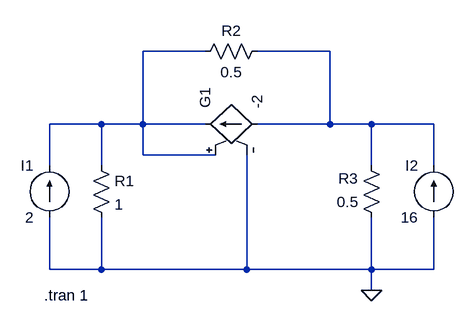
[diagram p0: schematic g3_p11.asc]
g3_p11.asc, the LTspice schematic file:
Version 4
SHEET 1 880 680
WIRE 128 -32 32 -32
WIRE 320 -32 208 -32
WIRE -32 80 -112 80
WIRE 32 80 32 -32
WIRE 32 80 -32 80
WIRE 128 80 32 80
WIRE 320 80 320 -32
WIRE 320 80 208 80
WIRE 384 80 320 80
WIRE 480 80 384 80
WIRE 32 128 32 80
WIRE 144 128 32 128
WIRE -112 144 -112 80
WIRE -32 144 -32 80
WIRE 384 144 384 80
WIRE 480 144 480 80
WIRE -112 304 -112 224
WIRE -32 304 -32 224
WIRE -32 304 -112 304
WIRE 192 304 192 128
WIRE 192 304 -32 304
WIRE 384 304 384 224
WIRE 384 304 192 304
WIRE 480 304 480 224
WIRE 480 304 384 304
WIRE 384 336 384 304
FLAG 384 336 0
SYMBOL res -48 128 R0
SYMATTR InstName R1
SYMATTR Value 1
SYMBOL res 224 -48 R90
WINDOW 0 0 56 VBottom 2
WINDOW 3 32 56 VTop 2
SYMATTR InstName R2
SYMATTR Value 0.5
SYMBOL res 400 240 R180
WINDOW 0 36 76 Left 2
WINDOW 3 36 40 Left 2
SYMATTR InstName R3
SYMATTR Value 0.5
SYMBOL current -112 224 R180
WINDOW 0 24 80 Left 2
WINDOW 3 24 0 Left 2
SYMATTR InstName I1
SYMATTR Value 2
SYMBOL current 480 224 R180
WINDOW 0 24 80 Left 2
WINDOW 3 24 0 Left 2
SYMATTR InstName I2
SYMATTR Value 16
SYMBOL g 112 80 R270
SYMATTR InstName G1
SYMATTR Value -2
TEXT -120 344 Left 2 !.tran 1

The netlist it stands for:
* g3_p11.asc
R1 N001 0 1
R2 N002 N001 0.5
R3 0 N002 0.5
I1 0 N001 2
I2 0 N002 16
G1 N002 N001 N001 0 -2
.tran 1
.backanno
.end